# Altium schematic sheet Display.SchDoc
size A4; SheetNumber: 6; SheetTotal: 8
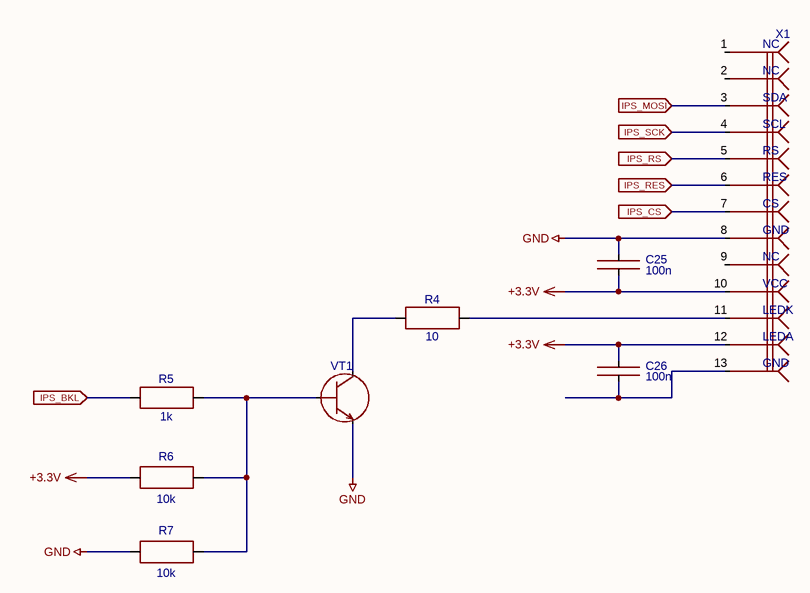
[diagram p0: Display.SchDoc]

## Parts
C25  100n  [CAPC1608X09N]
C26  100n  [CAPC1608X09N]
R4  10  [RESC2012X05N]
R5  1k  [RESC1608X05N]
R6  10k  [RESC2012X05N]
R7  10k  [RESC2012X05N]
VT1  BC817  [SOT23127P600-8N]  (value not drawn)
X1  IPC-1.14  [144-IPS]  (value not drawn)

## Ports
IPS_BKL (in), IPS_CS (in), IPS_MOSI (in), IPS_RES (in), IPS_RS (in), IPS_SCK (in)

## Nets
+3.3V: C25.1 C26.2 R6.2 X1.10(SHIELD) X1.12(SHIELD)
GND: C25.2 R7.2 VT1.E X1.8(SHIELD)
IPS_BKL: R5.1 ; port IPS_BKL
IPS_CS: X1.7(SHIELD) ; port IPS_CS
IPS_MOSI: X1.3(D+) ; port IPS_MOSI
IPS_RES: X1.6(SHIELD) ; port IPS_RES
IPS_RS: X1.5(GND) ; port IPS_RS
IPS_SCK: X1.4(ID) ; port IPS_SCK
NetC26_1: C26.1 X1.13(SHIELD)
NetR4_1: R4.1 VT1.C
NetR4_2: R4.2 X1.11(SHIELD)
NetR5_2: R5.2 R6.1 R7.1 VT1.B

Not connected (* = marked no-connect by the designer): X1 1(VBUS) 2(D-) 9(SHIELD)

## Notes on the sheet
- (in symbol IPC-1.14) NC; SDA; SCL; RS; RES; CS; VCC; LEDK; LEDA

## Library data of the parts
C25 C26 = C0603-100n-25V-X7R-10%: GRM188R71E104KA01D
R4 = R-0805-10-5%
R5 = R-0603-1k-5%
R6 R7 = R-0805-10k-5%
VT1 = BC817-16LT1G: Транзистор NPN 45В 0.5А 0.31Вт